# Altium schematic sheet KIT_STM32F103C8T6_V2.SchDoc
size A
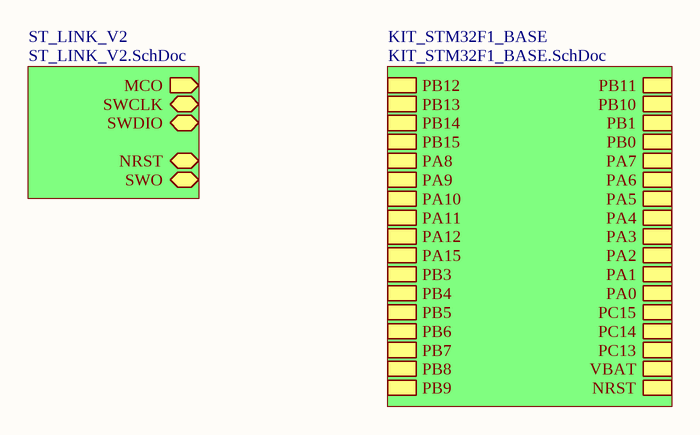
[diagram p0: KIT_STM32F103C8T6_V2.SchDoc]

## Sub-sheets
KIT_STM32F1_BASE = KIT_STM32F1_BASE.SchDoc: PB12, PB13, PB14, PB15, PA8, PA9, PA10, PA11, PA12, PA15, PB3, PB4, PB5, PB6, PB7, PB8, PB9, PB11, PB10, PB1, PB0, PA7, PA6, PA5, PA4, PA3, PA2, PA1, PA0, PC15, PC14, PC13, VBAT, NRST
ST_LINK_V2 = ST_LINK_V2.SchDoc: SWCLK (bidir), SWDIO (bidir), NRST (bidir), SWO (bidir), MCO (out)